# Altium schematic sheet CAN.SchDoc
size 100 x 100 mm; SheetNumber: 13; SheetTotal: 13
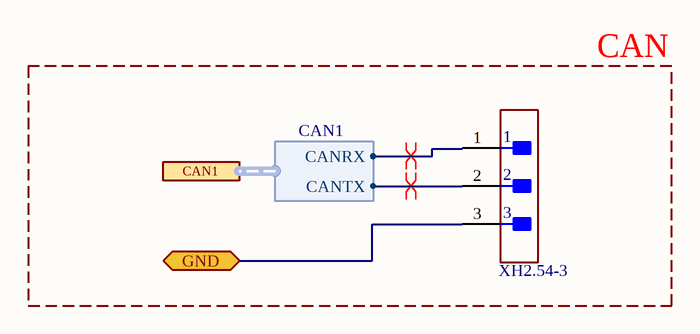
[diagram p0: CAN.SchDoc]

## Parts
CAN  XH2.54-3  [XH2.54-3]

## Blocks framed on the sheet
CAN: CAN

## Ports
CAN1 (harness CAN1, see CONTROL_PCB_MAIN[4D], STM32[2B]), GND (bidir, see CONTROL_PCB_MAIN[4D], ADC1[2D], I2C[2D], I_O[1C], LEDS[1D], MOTORS[2D], RELAY_5V_3.3V_LEVEL[5C], RELAY_12VV_VDD_LEVEL[5B], SPI[1D], STM32[1D], UARTSTM[2D])

## Harnesses
CAN1: CANTX, CANRX

## Nets
GND: CAN.3 ; port GND
NetCAN_1: CAN.1 ; port CAN1.CANRX
NetCAN_2: CAN.2 ; port CAN1.CANTX

## Layout directives
differential pair: NetCAN_1, NetCAN_2

## Library data of the parts
CAN = XH2.54-3: JST XH2.54-3pin